# EAGLE design sibu-led-board (EAGLE 7.6.0)
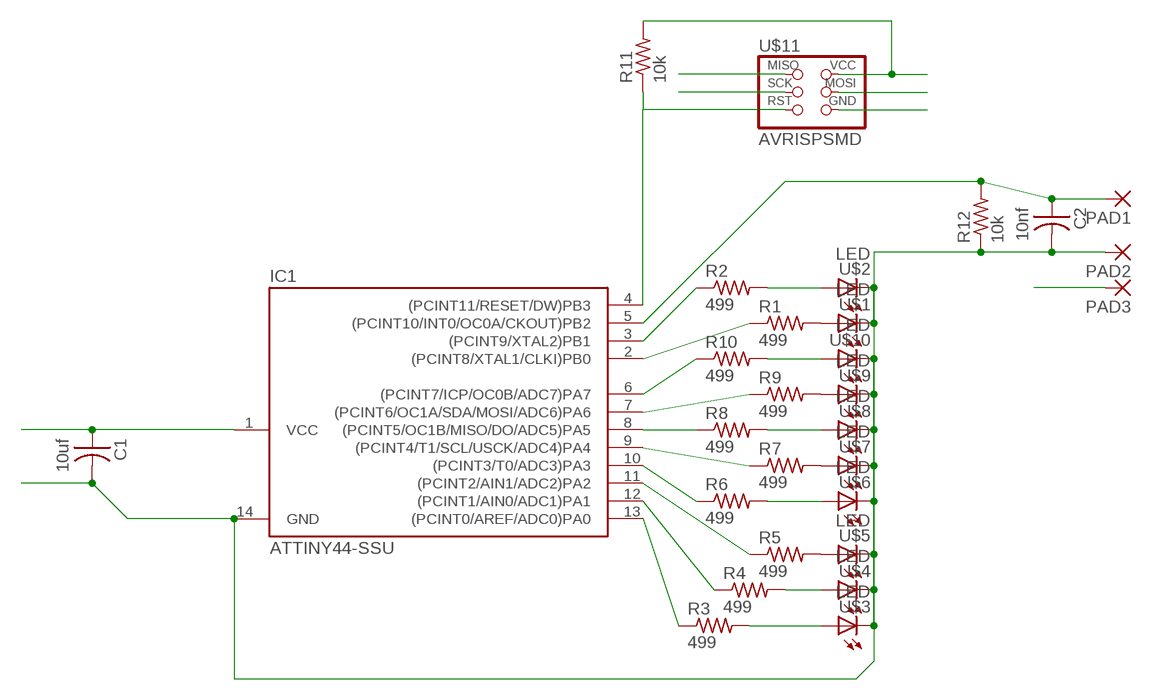
[diagram p0: schematic, sheet 1]

## Parts
C1  10uf  CAP-US1206FAB  [C1206FAB]
C2  10nf  CAP-US1206FAB  [C1206FAB]
IC1  ATTINY44-SSU  [SOIC14]
PAD1  SMD2  [SMD1,27-2,54]
PAD2  SMD2  [SMD1,27-2,54]
PAD3  SMD2  [SMD1,27-2,54]
R1  499  RES-US1206FAB  [R1206FAB]
R2  499  RES-US1206FAB  [R1206FAB]
R3  499  RES-US1206FAB  [R1206FAB]
R4  499  RES-US1206FAB  [R1206FAB]
R5  499  RES-US1206FAB  [R1206FAB]
R6  499  RES-US1206FAB  [R1206FAB]
R7  499  RES-US1206FAB  [R1206FAB]
R8  499  RES-US1206FAB  [R1206FAB]
R9  499  RES-US1206FAB  [R1206FAB]
R10  499  RES-US1206FAB  [R1206FAB]
R11  10k  RES-US1206FAB  [R1206FAB]
R12  10k  RES-US1206FAB  [R1206FAB]
U$1  LED  LEDFAB1206  [LED1206FAB]
U$2  LED  LEDFAB1206  [LED1206FAB]
U$3  LED  LEDFAB1206  [LED1206FAB]
U$4  LED  LEDFAB1206  [LED1206FAB]
U$5  LED  LEDFAB1206  [LED1206FAB]
U$6  LED  LEDFAB1206  [LED1206FAB]
U$7  LED  LEDFAB1206  [LED1206FAB]
U$8  LED  LEDFAB1206  [LED1206FAB]
U$9  LED  LEDFAB1206  [LED1206FAB]
U$10  LED  LEDFAB1206  [LED1206FAB]
U$11  AVRISPSMD  [2X03SMD]

## Nets
A0: R3.2 U$3.1(A)
A1: R4.2 U$4.1(A)
A2: R5.2 U$5.1(A)
A3: R6.2 U$6.1(A)
A4: R7.2 U$7.1(A)
A5: R8.2 U$8.1(A)
A6: R9.2 U$9.1(A)
A7: R10.2 U$10.1(A)
B0: R1.2 U$1.1(A)
B1: R2.2 U$2.1(A)
DATA_IN: C2.1 IC1.5((PCINT10/INT0/OC0A/CKOUT)PB2) PAD1.1(P) R12.2
GND: C1.2 C2.2 IC1.14(GND) PAD2.1(P) R12.1 U$1.2(C) U$2.2(C) U$3.2(C) U$4.2(C) U$5.2(C) U$6.2(C) U$7.2(C) U$8.2(C) U$9.2(C) U$10.2(C) U$11.6(GND)
MISO: IC1.8((PCINT5/OC1B/MISO/DO/ADC5)PA5) R8.1 U$11.1(MISO)
MOSI: IC1.7((PCINT6/OC1A/SDA/MOSI/ADC6)PA6) R9.1 U$11.4(MOSI)
N$11: IC1.13((PCINT0/AREF/ADC0)PA0) R3.1
N$12: IC1.12((PCINT1/AIN0/ADC1)PA1) R4.1
N$13: IC1.11((PCINT2/AIN1/ADC2)PA2) R5.1
N$14: IC1.10((PCINT3/T0/ADC3)PA3) R6.1
N$15: IC1.2((PCINT8/XTAL1/CLKI)PB0) R1.1
N$16: IC1.3((PCINT9/XTAL2)PB1) R2.1
N$20: IC1.6((PCINT7/ICP/OC0B/ADC7)PA7) R10.1
RST: IC1.4((PCINT11/RESET/DW)PB3) R11.1 U$11.5(RST)
SCK: IC1.9((PCINT4/T1/SCL/USCK/ADC4)PA4) R7.1 U$11.3(SCK)
VCC: C1.1 IC1.1(VCC) PAD3.1(P) R11.2 U$11.2(VCC)

## Library data of the parts
C1 C2 = fab:CAP-US
IC1 = fab:ATTINY44
PAD1-PAD3 = wirepad:SMD2: SMD PAD
R1-R12 = fab:RES-US: Resistor (US Symbol) Variants with postfix FAB are widened to allow the routing of internal traces
U$1-U$10 = fab:LED: LED
U$11 = fab:AVRISP

## Board
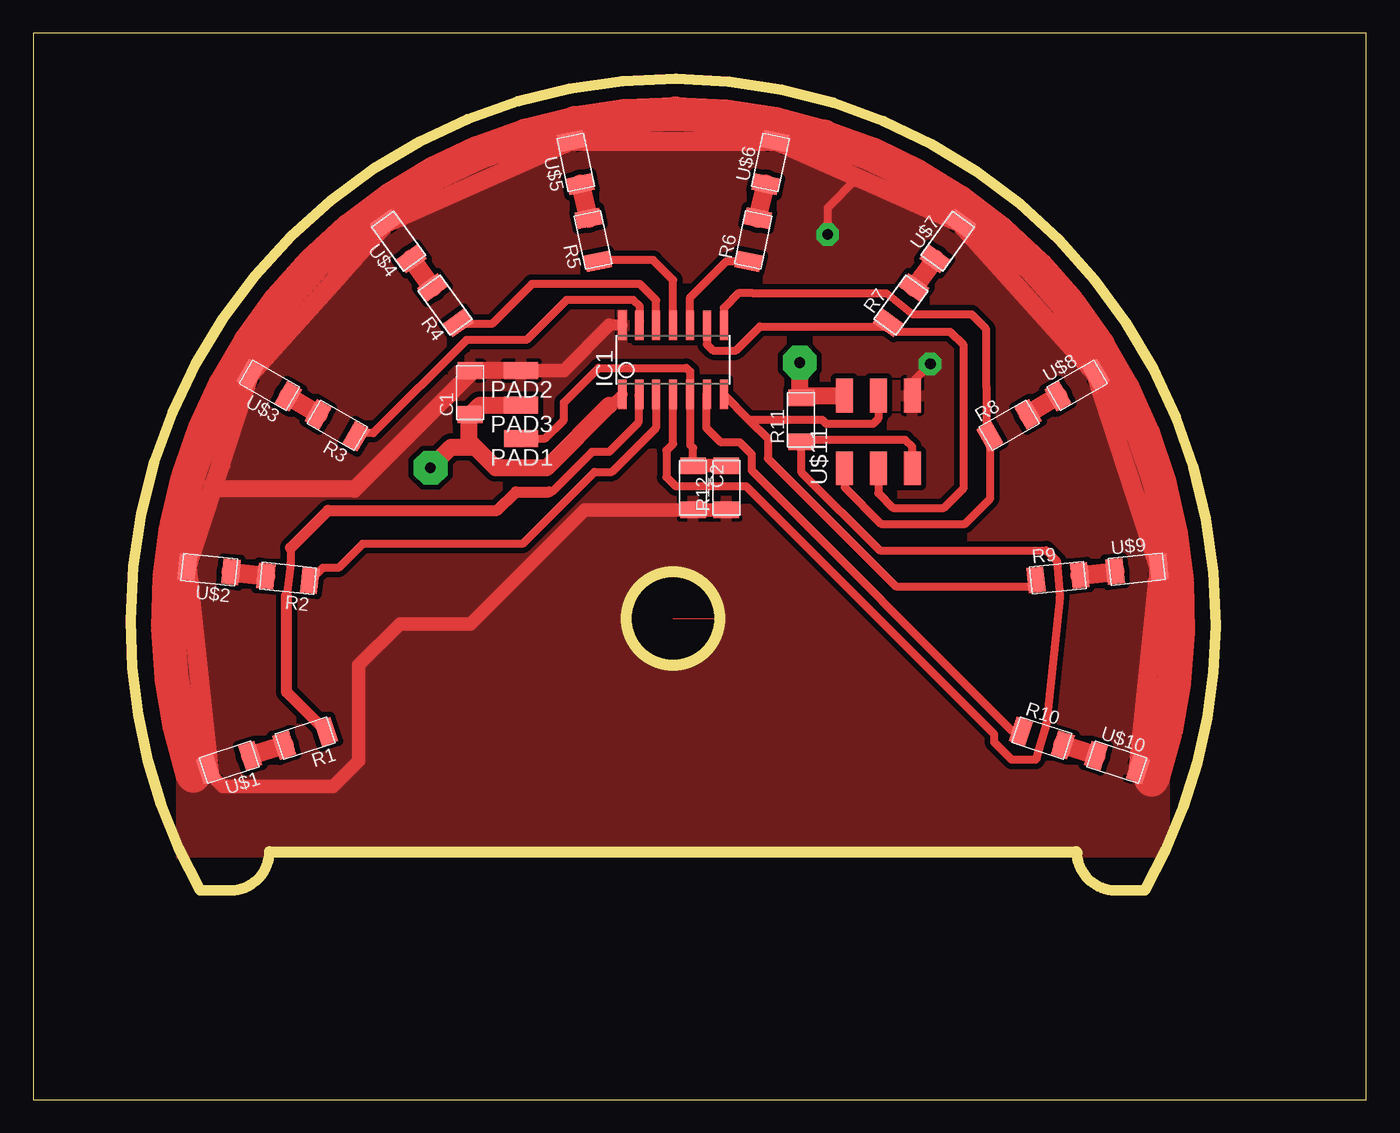
[diagram p1: board, top side]
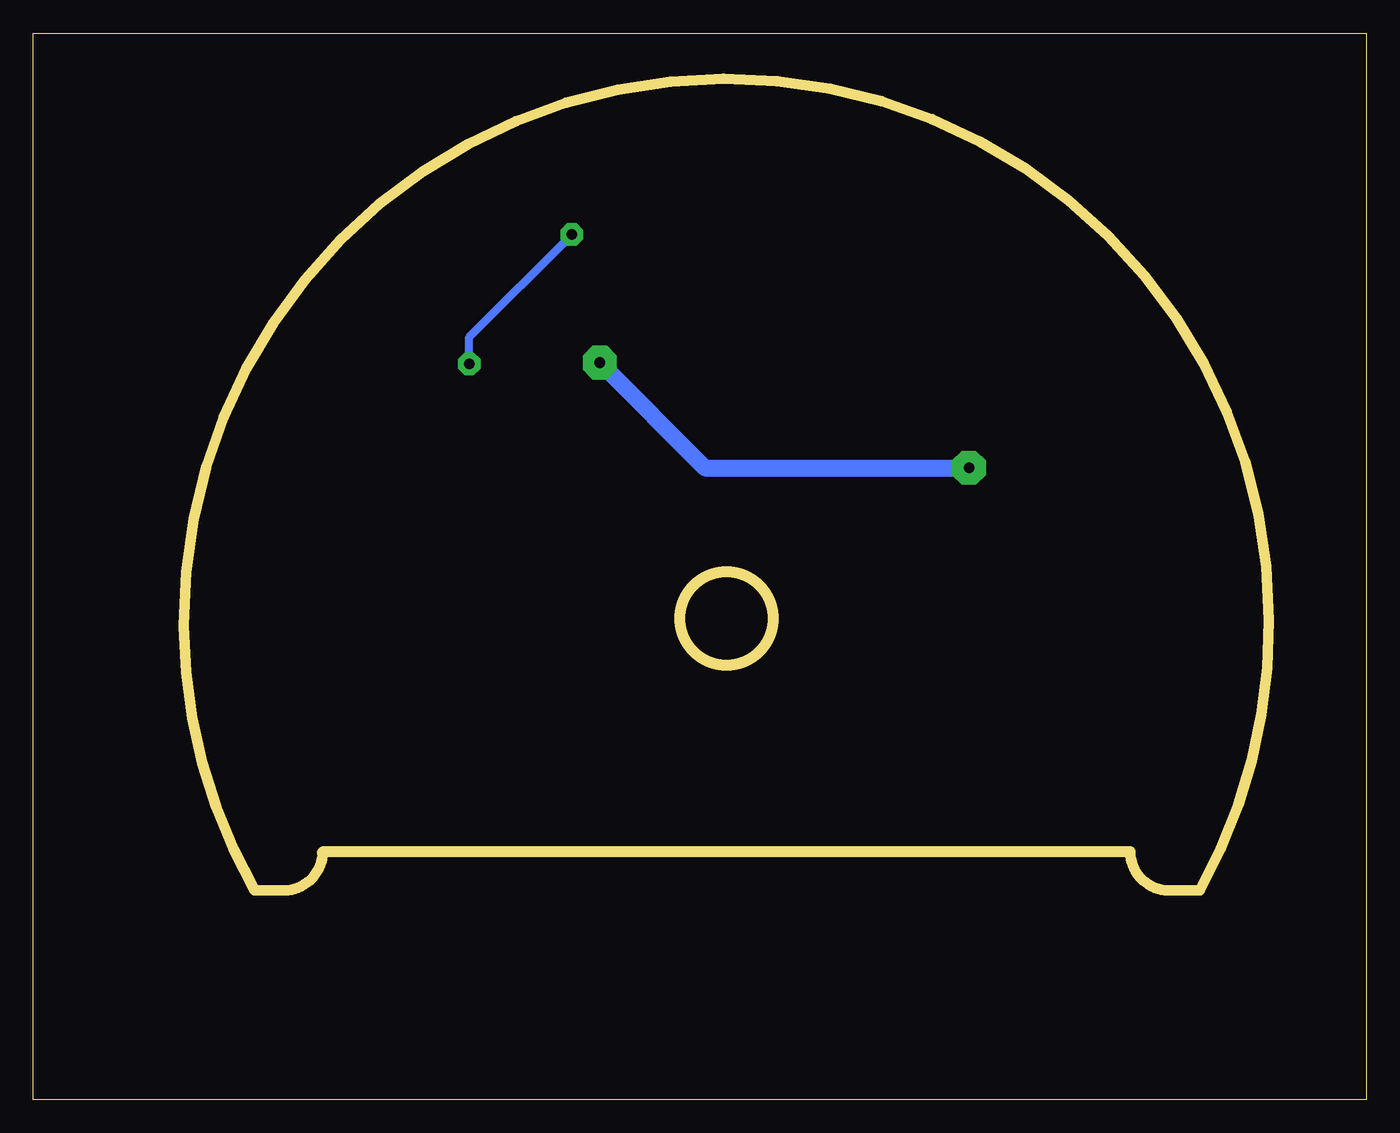
[diagram p2: board, bottom side, seen from below]

Size 100 x 80 mm. Coordinates in mm from the lower left corner, seen from the top.
Outline: 0,0 100,0 100,80 0,80 0,0
Copper layers (1*16): Top 0.035mm / dielectric 1.5mm / Bottom 0.035mm
Design rules "default *": minimum track width 0.6mm, minimum drill 0.8mm, track to track 0.4mm, track to pad 0.4mm, pad to pad 0.4mm, via to via 0.4mm, smd to smd 8mil, copper to edge 40mil, drill to drill 8mil, minimum pad ring 10mil, minimum via ring 8mil, stop-mask expansion 4mil, vias tented up to drill 0mil, thermal gap 10mil
Milling: area 44.5,32.6 to 51.5,39.6; 9 lines

### Footprints (pad centres in the part's own frame; a part is rotated, then mirrored left to right if it is on the bottom)
C1206FAB = smd 1.27 x 1.905: 1 -1.651,0; 2 1.651,0
SOIC14 = smd 0.61 x 2.21: 1 -3.81,-2.603; 2 -2.54,-2.603; 3 -1.27,-2.603; 4 0,-2.603; 5 1.27,-2.603; 6 2.54,-2.603; 7 3.81,-2.603; 8 3.81,2.603; 9 2.54,2.603; 10 1.27,2.603; 11 0,2.603; 12 -1.27,2.603; 13 -2.54,2.603; 14 -3.81,2.603
SMD1,27-2,54 = smd 1.27 x 2.54: 1 0,0
R1206FAB = smd 1.27 x 1.905: 1 -1.651,0; 2 1.651,0
LED1206FAB = smd 1.27 x 1.905: 1 -1.651,0; 2 1.651,0
2X03SMD = smd 2.54 x 1.27: 1 -2.54,2.54; 2 2.92,2.54; 3 -2.54,0; 4 2.92,0; 5 -2.54,-2.54; 6 2.92,-2.54

### Placement (x,y rotation side)
C1  32.77,53.04 90 top
C2  49.5,45.9 270 top
IC1  48,55.5 0 top
PAD1  36.6,49.6 90 top
PAD2  36.6,54.7 90 top
PAD3  36.6,52.1 90 top
R1  20.4,27.1 198 top
R2  19.1,39.1 174 top
R3  22.8,50.6 150 top
R4  30.9,59.6 126 top
R5  42,64.5 102 top
R6  54.01,64.51 78 top
R7  65.1,59.6 54 top
R8  73.2,50.6 30 top
R9  76.87,39.16 6 top
R10  75.66,27.12 342 top
R11  57.6,51 90 top
R12  52,45.9 90 top
U$1  14.7,25.3 198 top
U$2  13.19,39.76 174 top
U$3  17.7,53.6 150 top
U$4  27.4,64.4 126 top
U$5  40.7,70.3 102 top
U$6  55.3,70.3 78 top
U$7  68.6,64.4 54 top
U$8  78.3,53.6 30 top
U$9  82.8,39.8 6 top
U$10  81.3,25.3 342 top
U$11  63.4,49.9 90 top

### Tracks (layer width: path | path; a pad name or v marks a point on that pad's centre or on a via)
A0
  Top 1.422: U$3.1 R3.2
A1
  Top 1.422: U$4.1 R4.2
A2
  Top 1.422: R5.2 U$5.1
A3
  Top 1.422: R6.2 U$6.1
A4
  Top 1.422: U$7.1 R7.2
A5
  Top 1.422: U$8.1 R8.2
A6
  Top 1.422: R9.2 U$9.1
A7
  Top 1.422: U$10.1 R10.2
B0
  Top 1.422: U$1.1 R1.2
B1
  Top 1.422: U$2.1 R2.2
DATA_IN
  Top 0.61: PAD1.1 38.4,49.6 39.8,51 39.8,52.3 42.4,54.9 49,54.9 49.27,54.63 IC1.5 49.3,52.87 49.3,49.1 49.5,48.9 C2.1
  Top 1.016: C2.1 R12.2
GND  (via drill 0.8 pad 1.68)
  Top 0.6: 14,46.6 13.75,46.68 | 14.5,47.5 14.06,47.64
  Top 0.61: U$11.6 65.94,53.84 v67.3,55.2 | v59.6,64.9 59.6,66.91 61.85,69.16
  Top 0.813: 13.47,45.6 13.41,45.66 | IC1.14 43.2,58.1
  Top 1.016: 43.2,58.1 39.8,54.7 PAD2.1 | R12.1 C2.2 41.35,44.25 32.8,35.7 27.5,35.7 24.4,32.6 24.4,25.4 22.5,23.5 14.22,23.5 13.13,24.59 U$1.2
  Top 1.27: PAD2.1 C1.2 32.77,54.47 24.1,45.8 13.79,45.8 13.54,46.05
  Top 1.422: U$1.2 12.49,24.79 arc90 12,24.3 | U$2.2 10.37,39.93 arc-90 10.2,40.1 | 83.9,24 arc90 83.11,24.79 U$10.2 U$9.2 U$8.2 U$7.2 61.85,69.16 U$6.2 U$5.2 U$4.2 24.01,63.04 22.71,61.6 U$3.2 14.06,47.64 13.75,46.68 13.54,46.05 13.41,45.66 U$2.2 | U$2.2 13.2,24.6
  Top 2.54: 12,24.3 arc-217 83.9,24
  Bottom 0.61: v67.3,55.2 67.3,57.2 v59.6,64.9
  pour Top: 48,18.6 84.9,18.6 84.9,38 arc90 48.1,74.8 arc90 11.1,37.8 11.1,18.3 arc-90 11.4,18.6
MISO
  Top 0.6: 71.5,53.5 71.5,50 R8.1 | 54,60.5 64,60.5
  Top 0.61: 54,60.5 52.9,60.5 51.8,59.4 51.8,58.11 IC1.8 | U$11.1 60.86,45.94 63.6,43.2 69.9,43.2 71.8,45.1 71.8,49.74 R8.1 | 64,60.5 66,58.9 70.4,58.9 71.5,57.8 71.5,53.5
MOSI
  Top 0.61: U$11.4 63.4,51.1 63,50.7 59.5,50.7 59.2,51 53.71,51 | 53.71,51 IC1.7 | 53.71,51 55.1,49.61 55.1,48.1 64.7,38.5 74.75,38.5 R9.1
N$1
  Top 0: 48,36.1 51.5,36.1 | 51.5,36.1 arc90 48,39.6 arc90 44.5,36.1 arc90 48,32.6 arc90 51.5,36.1
N$11
  Top 0.6: R3.1 24.5,50 25.5,50 32.5,57 37,57 40,60 45,60 45.5,59.5 45.5,58.5 IC1.13
N$12
  Top 0.61: IC1.12 46.73,59.97 45.5,61.2 37.4,61.2 34.4,58.2 31.93,58.2 R4.1
N$13
  Top 0.61: IC1.11 48,61.5 46.5,63 42.46,63 R5.1
N$14
  Top 0.61: IC1.10 49.27,60.17 52,62.9 R6.1
N$15
  Top 0.6: 21.5,28.1 R1.1
  Top 0.61: IC1.2 45.4,52.84 45.4,50.8 43.2,48.6 41.9,48.6 38.9,45.6 36.2,45.6 | 19.3,41.4 19.3,40.2 19,37.8
  Top 0.813: R1.1 19,30.58 19,37.8 | 38.7,45.6 36.2,45.6 34.8,44.2 22.1,44.2 19.3,41.4
N$16
  Top 0.61: IC1.3 46.7,52.87 46.7,50.4 43.4,47.1 42.1,47.1 36.7,41.7 24.7,41.7 22.9,39.9 21.71,39.9 R2.1
N$20
  Top 0.61: R10.1 73.47,27.63 53.9,47.2 53.9,48.4 53,49.3 51.6,49.3 50.5,50.4 50.5,52.86 IC1.6
RST
  Top 0.61: U$11.5 65.94,48.96 65.4,49.5 57.75,49.5 R11.1 57.6,47.1 63.5,41.2 76,41.2 76.8,40.4 77,37.7 76,28.2 75.4,26.2 75.2,25.5 73.4,25.5 72.1,26.8 72.1,27.4 53.5,46 48.2,46 47.5,46.7 47.5,48.7 48,49.2 IC1.4
SCK
  Top 0.6: 54.5,58 64,58 R7.1
  Top 0.61: IC1.9 50.54,56.66 51,56.2 52.7,56.2 54.5,58 | U$11.3 63.4,45.5 64.5,44.4 68.3,44.4 69.8,45.9 69.8,56.6 68.8,57.6 64.79,57.6 R7.1
VCC  (via drill 0.8 pad 2.54)
  Top 0.61: 60.69,52.65 U$11.2
  Top 0.813: IC1.1 43.39,52.1 43.2,52.1
  Top 1.27: PAD3.1 33.48,52.1 C1.1 32.7,51.32 32.7,49.4 33.15,48.95 | 43.2,52.1 38.5,47.4 34.7,47.4 33.15,48.95 | U$11.2 57.77,52.82 R11.2 57.5,52.75 v57.5,55.3 | v29.8,47.4 31.35,48.95 33.15,48.95
  Bottom 1.27: v57.5,55.3 49.6,47.4 v29.8,47.4